# Altium schematic sheet Motors.SchDoc
size A4; DrawnBy: Lorna Lan, Dylan Vogel; DocumentNumber: 11; Revision: v4.2; SheetNumber: 11; SheetTotal: 20
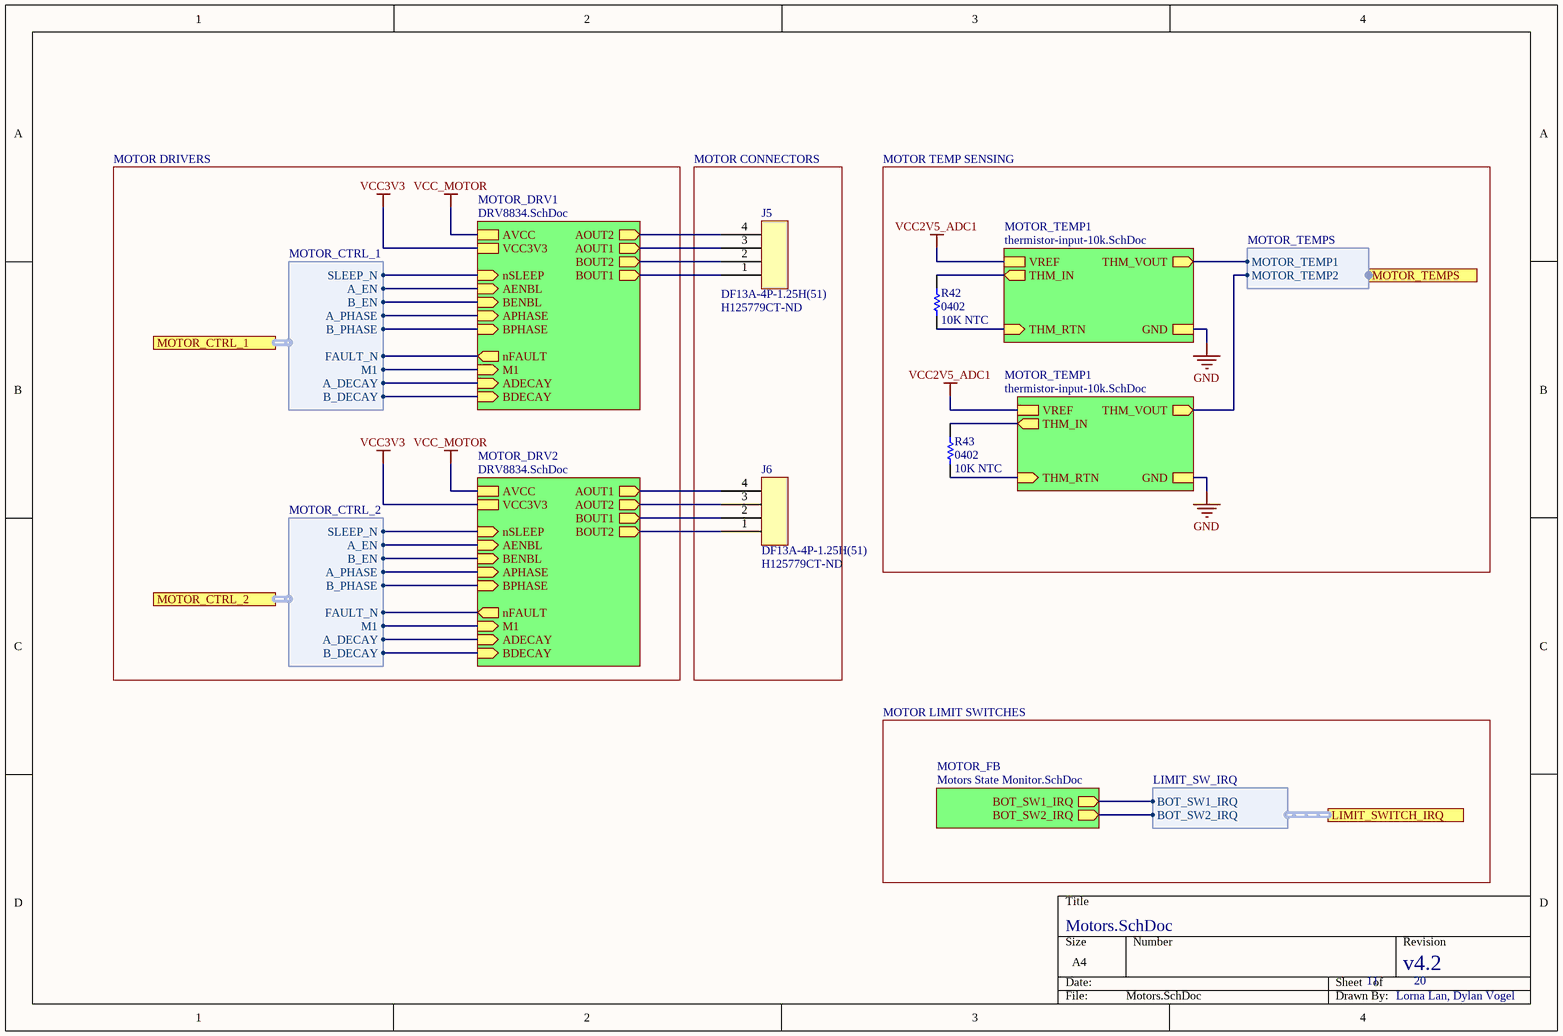
[diagram p0: Motors.SchDoc]

## Parts
J5  DF13A-4P-1.25H(51)  Supplier Part Number 1: H125779CT-ND  [DF13A-4P-1.25H(51)]
J6  DF13A-4P-1.25H(51)  Supplier Part Number 1: H125779CT-ND  [DF13A-4P-1.25H(51)]
R42  0402  value 10K NTC  [RES0402R]
R43  0402  value 10K NTC  [RES0402R]

## Blocks framed on the sheet
MOTOR CONNECTORS: J5 J6
MOTOR TEMP SENSING: R42 R43

## Sub-sheets
MOTOR_DRV1 = DRV8834.SchDoc: nSLEEP (in), nFAULT (out), AVCC, M1 (in), ADECAY (in), BDECAY (in), BPHASE (in), BENBL (in), APHASE (in), AENBL (in), VCC3V3, AOUT1 (out), BOUT2 (out), BOUT1 (out), AOUT2 (out)
MOTOR_DRV2 = DRV8834.SchDoc: nSLEEP (in), nFAULT (out), AVCC, M1 (in), ADECAY (in), BDECAY (in), BPHASE (in), BENBL (in), APHASE (in), AENBL (in), VCC3V3, BOUT2 (out), BOUT1 (out), AOUT2 (out), AOUT1 (out)
MOTOR_FB = Motors State Monitor.SchDoc: BOT_SW2_IRQ (out), BOT_SW1_IRQ (out)
MOTOR_TEMP1 = thermistor-input-10k.SchDoc: GND, VREF, THM_RTN (in), THM_IN (out), THM_VOUT (out)
MOTOR_TEMP1 = thermistor-input-10k.SchDoc: GND, VREF, THM_RTN (in), THM_IN (out), THM_VOUT (out)

## Ports
LIMIT_SWITCH_IRQ (harness LIMIT_SW_IRQ), MOTOR_CTRL_1 (harness MOTOR_CTRL_1), MOTOR_CTRL_2 (harness MOTOR_CTRL_2), MOTOR_TEMPS (harness MOTOR_TEMPS)

## Harnesses
MOTOR_CTRL_1: SLEEP_N, A_EN, B_EN, A_PHASE, B_PHASE, FAULT_N, M1, A_DECAY, B_DECAY
MOTOR_CTRL_2: SLEEP_N, A_EN, B_EN, A_PHASE, B_PHASE, FAULT_N, M1, A_DECAY, B_DECAY
LIMIT_SW_IRQ: BOT_SW1_IRQ, BOT_SW2_IRQ
MOTOR_TEMPS: MOTOR_TEMP1, MOTOR_TEMP2

## Nets
GND: sheet MOTOR_TEMP1/GND, sheet MOTOR_TEMP1/GND
VCC2V5_ADC1: sheet MOTOR_TEMP1/VREF, sheet MOTOR_TEMP1/VREF
VCC3V3: sheet MOTOR_DRV1/VCC3V3, sheet MOTOR_DRV2/VCC3V3
VCC_MOTOR: sheet MOTOR_DRV1/AVCC, sheet MOTOR_DRV2/AVCC
NetJ5_1: J5.1 ; sheet MOTOR_DRV1/BOUT1
NetJ5_2: J5.2 ; sheet MOTOR_DRV1/BOUT2
NetJ5_3: J5.3 ; sheet MOTOR_DRV1/AOUT1
NetJ5_4: J5.4 ; sheet MOTOR_DRV1/AOUT2
NetJ6_1: J6.1 ; sheet MOTOR_DRV2/BOUT2
NetJ6_2: J6.2 ; sheet MOTOR_DRV2/BOUT1
NetJ6_3: J6.3 ; sheet MOTOR_DRV2/AOUT2
NetJ6_4: J6.4 ; sheet MOTOR_DRV2/AOUT1
NetR42_1: R42.1 ; sheet MOTOR_TEMP1/THM_RTN
NetR42_2: R42.2 ; sheet MOTOR_TEMP1/THM_IN
NetR43_1: R43.1 ; sheet MOTOR_TEMP1/THM_RTN
NetR43_2: R43.2 ; sheet MOTOR_TEMP1/THM_IN
(unnamed): sheet MOTOR_FB/BOT_SW2_IRQ, port LIMIT_SWITCH_IRQ.BOT_SW2_IRQ
(unnamed): sheet MOTOR_FB/BOT_SW1_IRQ, port LIMIT_SWITCH_IRQ.BOT_SW1_IRQ
(unnamed): sheet MOTOR_DRV1/nSLEEP, port MOTOR_CTRL_1.SLEEP_N
(unnamed): sheet MOTOR_DRV1/nFAULT, port MOTOR_CTRL_1.FAULT_N
(unnamed): sheet MOTOR_DRV1/M1, port MOTOR_CTRL_1.M1
(unnamed): sheet MOTOR_DRV1/ADECAY, port MOTOR_CTRL_1.A_DECAY
(unnamed): sheet MOTOR_DRV1/BDECAY, port MOTOR_CTRL_1.B_DECAY
(unnamed): sheet MOTOR_DRV1/BPHASE, port MOTOR_CTRL_1.B_PHASE
(unnamed): sheet MOTOR_DRV1/BENBL, port MOTOR_CTRL_1.B_EN
(unnamed): sheet MOTOR_DRV1/APHASE, port MOTOR_CTRL_1.A_PHASE
(unnamed): sheet MOTOR_DRV1/AENBL, port MOTOR_CTRL_1.A_EN
(unnamed): sheet MOTOR_DRV2/nSLEEP, port MOTOR_CTRL_2.SLEEP_N
(unnamed): sheet MOTOR_DRV2/nFAULT, port MOTOR_CTRL_2.FAULT_N
(unnamed): sheet MOTOR_DRV2/M1, port MOTOR_CTRL_2.M1
(unnamed): sheet MOTOR_DRV2/ADECAY, port MOTOR_CTRL_2.A_DECAY
(unnamed): sheet MOTOR_DRV2/BDECAY, port MOTOR_CTRL_2.B_DECAY
(unnamed): sheet MOTOR_DRV2/BPHASE, port MOTOR_CTRL_2.B_PHASE
(unnamed): sheet MOTOR_DRV2/BENBL, port MOTOR_CTRL_2.B_EN
(unnamed): sheet MOTOR_DRV2/APHASE, port MOTOR_CTRL_2.A_PHASE
(unnamed): sheet MOTOR_DRV2/AENBL, port MOTOR_CTRL_2.A_EN
(unnamed): sheet MOTOR_TEMP1/THM_VOUT, port MOTOR_TEMPS.MOTOR_TEMP1
(unnamed): sheet MOTOR_TEMP1/THM_VOUT, port MOTOR_TEMPS.MOTOR_TEMP2

## Notes on the sheet
- MOTOR DRIVERS
- MOTOR LIMIT SWITCHES

## Library data of the parts
J5 J6 = DF13A-4P-1.25H(51): 4 pos DF13 right angle surface mount connector; Supplier 1: Digi-Key
R42 R43 = RES0402: 0402 resistor